# Altium schematic sheet lv_io_pressure.SchDoc
size A4; Organization: Badgerloop; Address1: 133 Engineering Research; Address2: Building; Address3: Madison, WI 53715
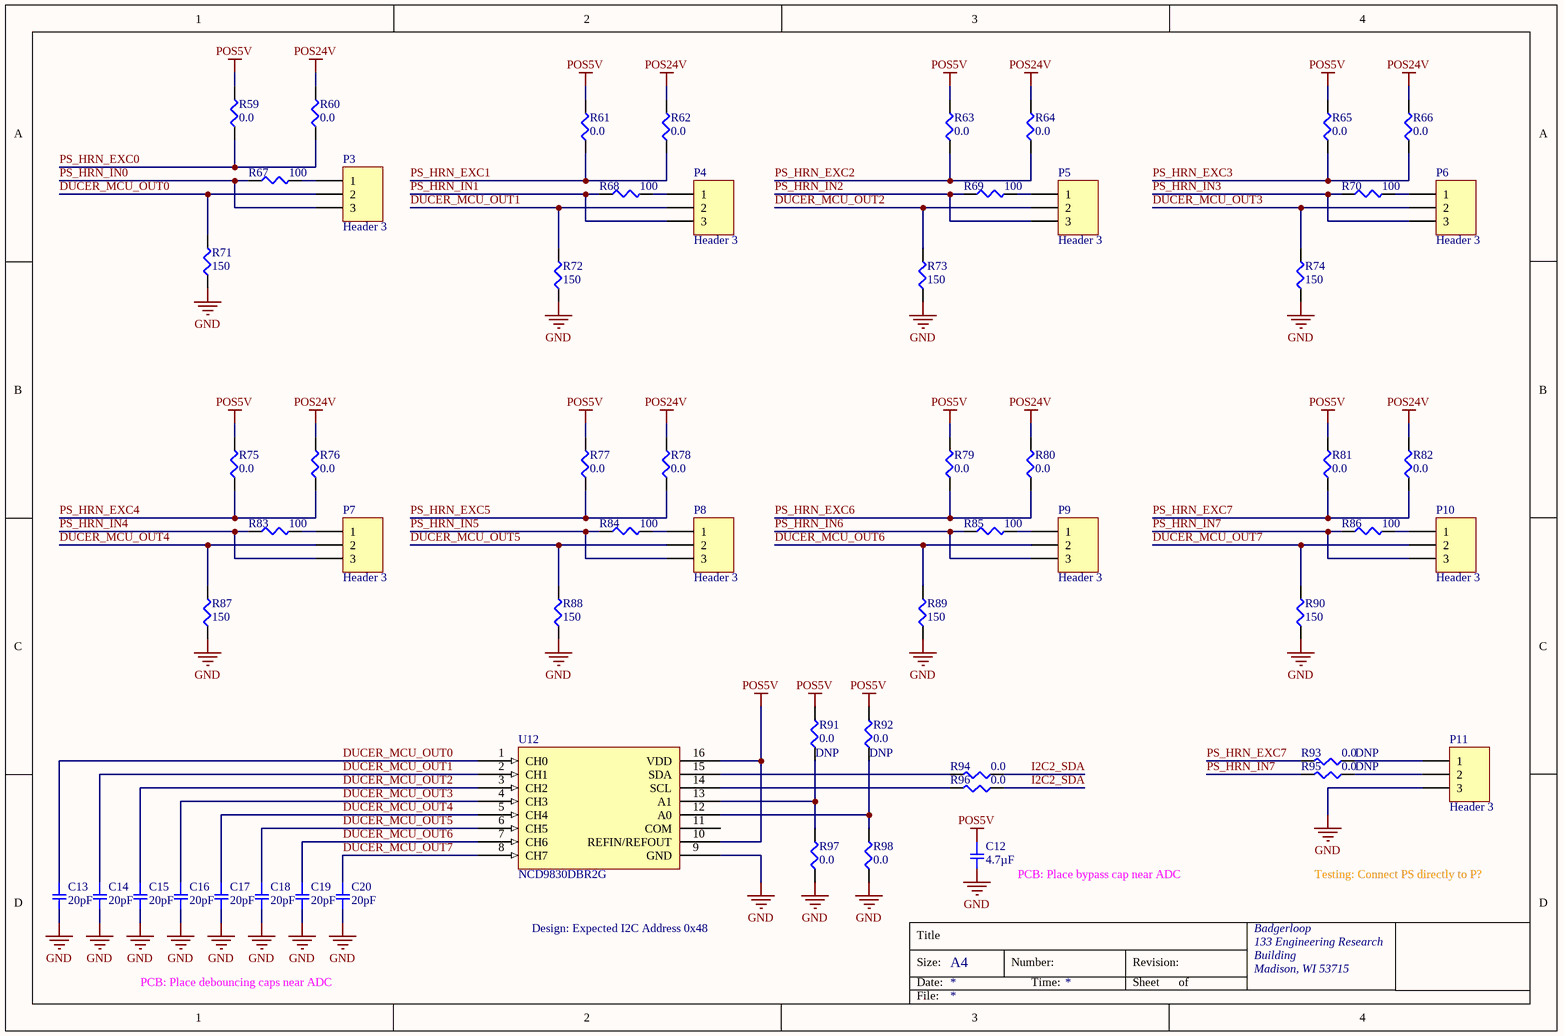
[diagram p0: lv_io_pressure.SchDoc]

## Parts
C12  4.7µF  [SMD-0805C]
C13  20pF  [SMD-0402C]
C14  20pF  [SMD-0402C]
C15  20pF  [SMD-0402C]
C16  20pF  [SMD-0402C]
C17  20pF  [SMD-0402C]
C18  20pF  [SMD-0402C]
C19  20pF  [SMD-0402C]
C20  20pF  [SMD-0402C]
P3  Header 3  [Pin Header 1x3 TH Pitch 2.54mm]
P4  Header 3  [Pin Header 1x3 TH Pitch 2.54mm]
P5  Header 3  [Pin Header 1x3 TH Pitch 2.54mm]
P6  Header 3  [Pin Header 1x3 TH Pitch 2.54mm]
P7  Header 3  [Pin Header 1x3 TH Pitch 2.54mm]
P8  Header 3  [Pin Header 1x3 TH Pitch 2.54mm]
P9  Header 3  [Pin Header 1x3 TH Pitch 2.54mm]
P10  Header 3  [Pin Header 1x3 TH Pitch 2.54mm]
P11  Header 3  [Pin Header 1x3 TH Pitch 2.54mm]
R59  0.0  [SMD-0402-RES]
R60  0.0  [SMD-0402-RES]
R61  0.0  [SMD-0402-RES]
R62  0.0  [SMD-0402-RES]
R63  0.0  [SMD-0402-RES]
R64  0.0  [SMD-0402-RES]
R65  0.0  [SMD-0402-RES]
R66  0.0  [SMD-0402-RES]
R67  100  [SMD-0402-RES]
R68  100  [SMD-0402-RES]
R69  100  [SMD-0402-RES]
R70  100  [SMD-0402-RES]
R71  150  [SMD-0603-RES]
R72  150  [SMD-0603-RES]
R73  150  [SMD-0603-RES]
R74  150  [SMD-0603-RES]
R75  0.0  [SMD-0402-RES]
R76  0.0  [SMD-0402-RES]
R77  0.0  [SMD-0402-RES]
R78  0.0  [SMD-0402-RES]
R79  0.0  [SMD-0402-RES]
R80  0.0  [SMD-0402-RES]
R81  0.0  [SMD-0402-RES]
R82  0.0  [SMD-0402-RES]
R83  100  [SMD-0402-RES]
R84  100  [SMD-0402-RES]
R85  100  [SMD-0402-RES]
R86  100  [SMD-0402-RES]
R87  150  [SMD-0603-RES]
R88  150  [SMD-0603-RES]
R89  150  [SMD-0603-RES]
R90  150  [SMD-0603-RES]
R91  0.0  [SMD-0402-RES]
R92  0.0  [SMD-0402-RES]
R93  0.0  [SMD-0402-RES]
R94  0.0  [SMD-0402-RES]
R95  0.0  [SMD-0402-RES]
R96  0.0  [SMD-0402-RES]
R97  0.0  [SMD-0402-RES]
R98  0.0  [SMD-0402-RES]
U12  NCD9830DBR2G

## Nets
GND: C12.2 C13.2 C14.2 C15.2 C16.2 C17.2 C18.2 C19.2 C20.2 P11.3 R71.1 R72.1 R73.1 R74.1 R87.1 R88.1 R89.1 R90.1 R97.1 R98.1 U12.9(GND)
POS5V: C12.1 R59.2 R61.2 R63.2 R65.2 R75.2 R77.2 R79.2 R81.2 R91.2 R92.2 U12.10(REFIN/REFOUT) U12.16(VDD)
POS24V: R60.2 R62.2 R64.2 R66.2 R76.2 R78.2 R80.2 R82.2
DUCER_MCU_OUT0: C13.1 P3.2 R71.2 U12.1(CH0)
DUCER_MCU_OUT1: C14.1 P4.2 R72.2 U12.2(CH1)
DUCER_MCU_OUT2: C15.1 P5.2 R73.2 U12.3(CH2)
DUCER_MCU_OUT3: C16.1 P6.2 R74.2 U12.4(CH3)
DUCER_MCU_OUT4: C17.1 P7.2 R87.2 U12.5(CH4)
DUCER_MCU_OUT5: C18.1 P8.2 R88.2 U12.6(CH5)
DUCER_MCU_OUT6: C19.1 P9.2 R89.2 U12.7(CH6)
DUCER_MCU_OUT7: C20.1 P10.2 R90.2 U12.8(CH7)
I2C2_SDA: R94.1 R96.1
PS_HRN_EXC0: R59.1 R60.1
PS_HRN_EXC1: R61.1 R62.1
PS_HRN_EXC2: R63.1 R64.1
PS_HRN_EXC3: R65.1 R66.1
PS_HRN_EXC4: R75.1 R76.1
PS_HRN_EXC5: R77.1 R78.1
PS_HRN_EXC6: R79.1 R80.1
PS_HRN_EXC7: R81.1 R82.1 R93.2
PS_HRN_IN0: P3.3 R67.1
PS_HRN_IN1: P4.3 R68.1
PS_HRN_IN2: P5.3 R69.1
PS_HRN_IN3: P6.3 R70.1
PS_HRN_IN4: P7.3 R83.1
PS_HRN_IN5: P8.3 R84.1
PS_HRN_IN6: P9.3 R85.1
PS_HRN_IN7: P10.3 R86.1 R95.2
NetP3_1: P3.1 R67.2
NetP4_1: P4.1 R68.2
NetP5_1: P5.1 R69.2
NetP6_1: P6.1 R70.2
NetP7_1: P7.1 R83.2
NetP8_1: P8.1 R84.2
NetP9_1: P9.1 R85.2
NetP10_1: P10.1 R86.2
NetP11_1: P11.1 R93.1
NetP11_2: P11.2 R95.1
NetR91_1: R91.1 R97.2 U12.13(A1)
NetR92_1: R92.1 R98.2 U12.12(A0)
NetR94_2: R94.2 U12.15(SDA)
NetR96_2: R96.2 U12.14(SCL)

Not connected (* = marked no-connect by the designer): U12 11(COM)

## Notes on the sheet
- (near C12) PCB: Place bypass cap near ADC
- Testing: Connect PS directly to P?
- PCB: Place debouncing caps near ADC
- Design: Expected I2C Address 0x48
- Title
- Size:
- Date:
- A4
- Number:
- Time:
- Revision:
- Sheet
- of
- File:

## Library data of the parts
C12 = GRM21BR60J475KA11L: CAP CER 4.7UF 6.3V X5R 0805; Manufacturer: Murata Electronics North America; Factory Stock: 0; Unit Price (USD): 0.28; Minimum Quantity: 1; Tolerance: ±10%; Datasheets: http://www.murata.com/~/media/webrenewal/support/library/catalog/products/capacitor/mlcc/c02e.pdf; Image: //media.digikey.com/Renders/Murata%20Renders/0805%20(2012%20Metric)%20.85mm.jpg; Digi-Key Part Number: 490-9749-1-ND; Part Number: GRM21BR60J475KA11L; Quantity Available: 2821; @ qty: 0; Packaging: Cut Tape (CT); Series: GRM; Part Status: Active; Value: 4.7µF; Voltage: 6.3V; Temperature Coefficient: X5R; Operating Temperature: -55°C ~ 85°C; Features: -; Ratings: -; Applications: General Purpose; Mounting Type: Surface Mount, MLCC; Package / Case: 0805 (2012 Metric); Size / Dimension: 0.079" L x 0.049" W (2.00mm x 1.25mm); Height - Seated (Max): -; Thickness (Max): 0.055" (1.40mm); Lead Spacing: -; Lead Style: -
C13-C20 = GJM1555C1H200JB01D: CAP CER 20PF 50V NP0 0402; Manufacturer: Murata Electronics North America; Factory Stock: 0; Unit Price (USD): 0.1; Minimum Quantity: 1; Tolerance: ±5%; Temperature Coefficient: C0G, NP0; Datasheets: http://www.murata.com/~/media/webrenewal/support/library/catalog/products/capacitor/mlcc/c02e.pdf; Image: //media.digikey.com/Renders/Murata%20Renders/ZRB-SERIES-0402.jpg; Digi-Key Part Number: 490-3120-1-ND; Part Number: GJM1555C1H200JB01D; Quantity Available: 13133; @ qty: 0; Packaging: Cut Tape (CT); Series: GJM; Part Status: Active; Value: 20pF; Voltage: 50V; Operating Temperature: -55°C ~ 125°C; Features: High Q, Low Loss; Ratings: -; Applications: RF, Microwave, High Frequency; Mounting Type: Surface Mount, MLCC; Package / Case: 0402 (1005 Metric); Size / Dimension: 0.039" L x 0.020" W (1.00mm x 0.50mm); Height - Seated (Max): -; Thickness (Max): 0.022" (0.55mm); Lead Spacing: -; Lead Style: -
P3-P11 = Header 3: Header, 3-Pin; LatestRevisionDate: 17-Jul-2002; LatestRevisionNote: Re-released for DXP Platform.; Publisher: Altium Limited
R59-R66 R75-R82 R91-R98 = ERJ-2GE0R00X: RES SMD 0.0OHM JUMPER 1/10W 0402; Manufacturer: Panasonic Electronic Components; Factory Stock: 0; Unit Price (USD): 0.00384; @ qty: 1500; Minimum Quantity: 1; Power (Watts): 0.1W, 1/10W; Part Number: ERJ-2GE0R00X; Datasheets: http://industrial.panasonic.com/www-cgi/jvcr13pz.cgi?E+PZ+3+AOA0001+ERJ2GE0R00X+7+WW; Image: //media.digikey.com/Photos/Panasonic%20Photos/ERJ-PA2-Series.jpg; Digi-Key Part Number: P0.0JCT-ND; Quantity Available: 3152483; Packaging: Cut Tape (CT); Series: ERJ; Part Status: Active; Value: 0.0; Tolerance: Jumper; Composition: Thick Film; Features: Automotive AEC-Q200; Temperature Coefficient: -; Operating Temperature: -55°C ~ 155°C; Package / Case: 0402 (1005 Metric); Supplier Device Package: 0402; Size / Dimension: 0.039" L x 0.020" W (1.00mm x 0.50mm); Height - Seated (Max): 0.016" (0.40mm); Number of Terminations: 2; Failure Rate: -
  R91-R93 R95: DNP: DNP
R67-R70 R83-R86 = ERJ-2GEJ101X: RES SMD 100 OHM 5% 1/10W 0402; Manufacturer: Panasonic Electronic Components; Factory Stock: 0; Unit Price (USD): 0.00350; @ qty: 1500; Minimum Quantity: 1; Power (Watts): 0.1W, 1/10W; Temperature Coefficient: ±200ppm/°C; Part Number: ERJ-2GEJ101X; Datasheets: http://industrial.panasonic.com/www-cgi/jvcr13pz.cgi?E+PZ+3+AOA0001+ERJ2GEJ101X+7+WW; Image: //media.digikey.com/Photos/Panasonic%20Photos/ERJ-PA2-Series.jpg; Digi-Key Part Number: P100JCT-ND; Quantity Available: 3114113; Packaging: Cut Tape (CT); Series: ERJ; Part Status: Active; Value: 100; Tolerance: ±5%; Composition: Thick Film; Features: Automotive AEC-Q200; Operating Temperature: -55°C ~ 155°C; Package / Case: 0402 (1005 Metric); Supplier Device Package: 0402; Size / Dimension: 0.039" L x 0.020" W (1.00mm x 0.50mm); Height - Seated (Max): 0.016" (0.40mm); Number of Terminations: 2; Failure Rate: -
R71-R74 R87-R90 = ERJ-P03D1500V: RES SMD 150 OHM 0.5% 1/5W 0603; Manufacturer: Panasonic Electronic Components; Factory Stock: 0; Unit Price (USD): 0.06582; @ qty: 1500; Minimum Quantity: 1; Power (Watts): 0.2W, 1/5W; Temperature Coefficient: ±150ppm/°C; Part Number: ERJ-P03D1500V; Datasheets: https://industrial.panasonic.com/cdbs/www-data/pdf/RDA0000/AOA0000C243.pdf; Image: //media.digikey.com/Photos/Panasonic%20Photos/MFG_ERJ-P6W%20Series.jpg; Digi-Key Part Number: P16013CT-ND; Quantity Available: 4150; Packaging: Cut Tape (CT); Series: ERJ; Part Status: Active; Value: 150; Tolerance: ±0.5%; Composition: Thick Film; Features: Automotive AEC-Q200, Pulse Withstanding; Operating Temperature: -55°C ~ 155°C; Package / Case: 0603 (1608 Metric); Supplier Device Package: 0603; Size / Dimension: 0.063" L x 0.031" W (1.60mm x 0.80mm); Height - Seated (Max): 0.022" (0.55mm); Number of Terminations: 2; Failure Rate: -
U12 = NCD9830DBR2G: IC ADC 8BIT 8CH I2C 16TSSOP; Manufacturer: ON Semiconductor; Digikey P/N: NCD9830DBR2GOSCT-ND; Digikey Link: https://www.digikey.com/product-detail/en/on-semiconductor/NCD9830DBR2G/NCD9830DBR2GOSCT-ND/9086945; Cost: 2.70; Manufacturer P/N: NCD9830DBR2G